# EAGLE design eurorack-passive-warp (EAGLE 9.6.2)
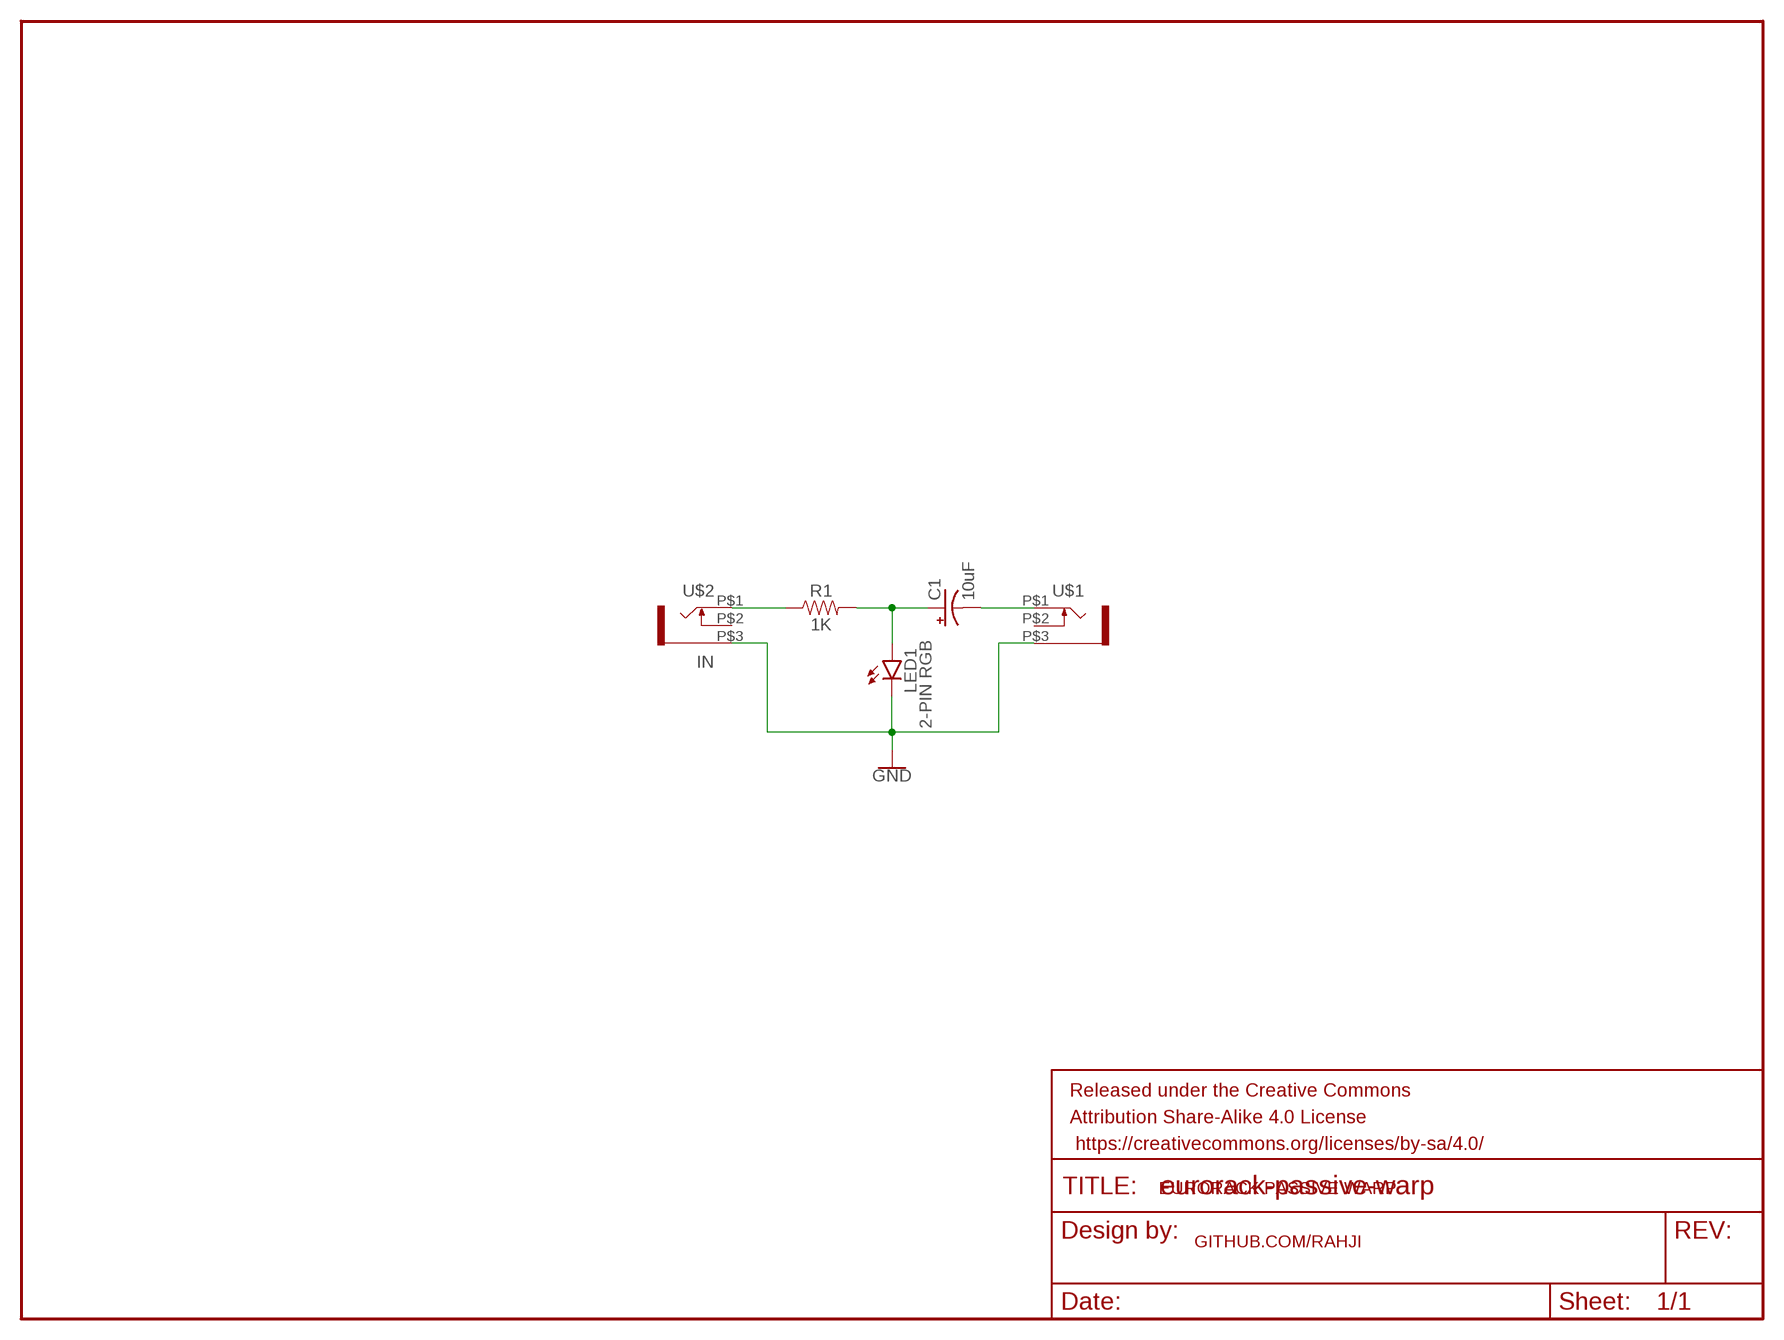
[diagram p0: schematic, sheet 1]

## Parts
C1  10uF  10UF-POLAR-RADIAL-2.5MM-25V-20%  [CPOL-RADIAL-2.5MM-5MM]
FRAME1  FRAME-LETTERNO_PACKAGE  [DUMMY]
LED1  2-PIN RGB  LED5MM  [LED5MM]
R1  1K  330OHM-HORIZ-1/10W-5%  [AXIAL-0.3]
U$1  OUT  WQP-PJ301M-12_JACK  [WQP-PJ301M-12_JACK]
U$2  IN  WQP-PJ301M-12_JACK  [WQP-PJ301M-12_JACK]

## Nets
GND: LED1.K(C) U$1.P$3 U$2.P$3
N$1: R1.P$1 U$2.P$1
N$2: C1.1(+) LED1.A R1.P$2
N$3: C1.2(-) U$1.P$1
Unconnected: U$1.P$2 U$2.P$2

## Notes on the sheet
- EURORACK PASSIVE WARP
- GITHUB.COM/RAHJI

## Library data of the parts
C1 = SparkFun-Capacitors:10UF-POLAR: 10.0µF polarized capacitors A capacitor is a passive two-terminal electrical component used to store electrical energy temporarily in an electric field.; PROD_ID: CAP-08440
FRAME1 = SparkFun-Aesthetics:FRAME-LETTER: Schematic Frame - Letter Standard 8.5x11 US Letter frame; DESIGNER: Nobody; VERSION: v01
LED1 = led:LED: LED OSRAM: - CHIPLED LG R971, LG N971, LY N971, LG Q971, LY Q971, LO R971, LY R971 LH N974, LH R974 LS Q976, LO Q976, LY Q976 LO Q996 - Hyper CHIPLED LW Q18S LB Q993, LB Q99A, LB R99A - SideLED LS A670, LO A670, LY A670, LG A670, LP A670 LB A673, LV A673, LT A673, LW A673 LH A674 LY A675 LS A676, LA A676, LO A676, LY A676, LW A676 LS A679, LY A679, LG A679 - Hyper Micro SIDELED® LS Y876, LA Y876, LO Y876, LY Y876 LT Y87S - SmartLED LW L88C, LW L88S LB L89C, LB L89S, LG L890 LS L89K, LO L89K, LY L89K LS L896, LA L896, LO L896, LY L896 - TOPLED LS T670, LO T670, LY T670, LG T670, LP T670 LSG T670, LSP T670, LSY T670, LOP T670, LYG T670 LG T671, LOG T671, LSG T671 LB T673, LV T673, LT T673, LW T673 LH T674 LS T676, LA T676, LO T676, LY T676, LB T676, LH T676, LSB T676, LW T676 LB T67C, LV T67C, LT T67C, LS T67K, LO T67K, LY T67K, LW E67C LS E67B, LA E67B, LO E67B, LY E67B, LB E67C, LV E67C, LT E67C LW T67C LS T679, LY T679, LG T679 LS T770, LO T770, LY T770, LG T770, LP T770 LB T773, LV T773, LT T773, LW T773 LH T774 LS E675, LA E675, LY E675, LS T675 LS T776, LA T776, LO T776, LY T776, LB T776 LHGB T686 LT T68C, LB T68C - Hyper Mini TOPLED® LB M676 - Mini TOPLED Santana® LG M470 LS M47K, LO M47K, LY M47K Source: http://www.osram.convergy.de LUXEON: - LUMILED® LXK2-PW12-R00, LXK2-PW12-S00, LXK2-PW14-U00, LXK2-PW14-V00 LXK2-PM12-R00, LXK2-PM12-S00, LXK2-PM14-U00 LXK2-PE12-Q00, LXK2-PE12-R00, LXK2-PE12-S00, LXK2-PE14-T00, LXK2-PE14-U00 LXK2-PB12-K00, LXK2-PB12-L00, LXK2-PB12-M00, LXK2-PB14-N00, LXK2-PB14-P00, LXK2-PB14-Q00 LXK2-PR12-L00, LXK2-PR12-M00, LXK2-PR14-Q00, LXK2-PR14-R00 LXK2-PD12-Q00, LXK2-PD12-R00, LXK2-PD12-S00 LXK2-PH12-R00, LXK2-PH12-S00 LXK2-PL12-P00, LXK2-PL12-Q00, LXK2-PL12-R00 Source: www.luxeon.com KINGBRIGHT: KA-3528ASYC Source: www.kingbright.com
R1 = SparkFun-Resistors:330OHM: 330Ω resistor A resistor is a passive two-terminal electrical component that implements electrical resistance as a circuit element. Resistors act to reduce current flow, and, at the same time, act to lower voltage levels within circuits. - Wikipedia; PROD_ID: RES-8371; VALUE: 330
U$1 U$2 = thonkiconn:WQP-PJ301M-12_JACK

## Board
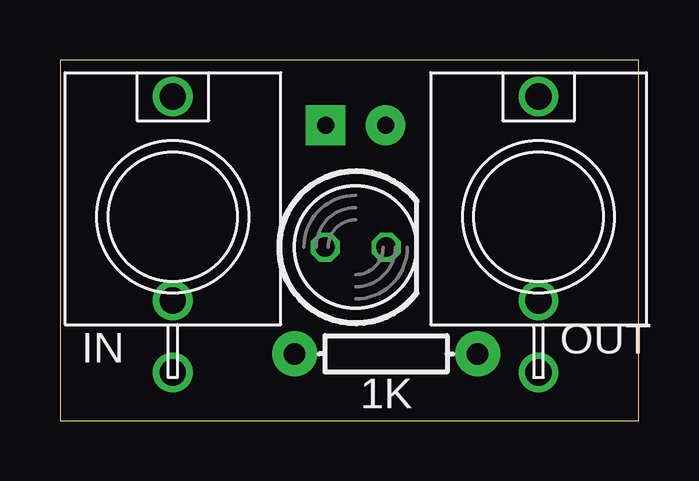
[diagram p1: board, top side]
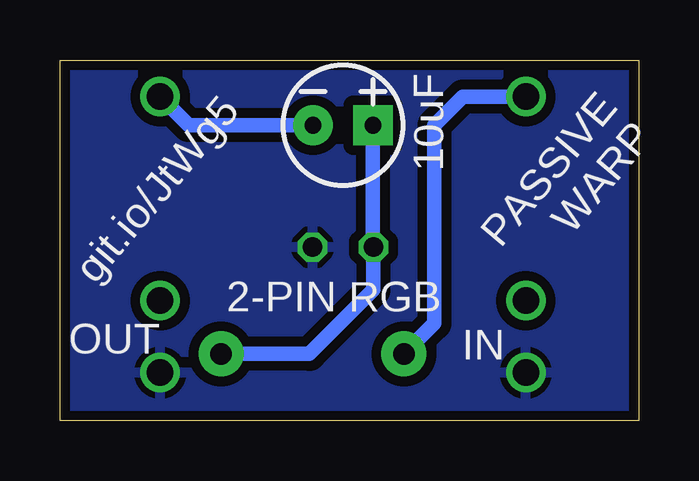
[diagram p2: board, bottom side, seen from below]

Size 24.11 x 15.04 mm. Coordinates in mm from the lower left corner, seen from the top.
Outline: 0,0 24.11,0 24.11,15.04 0,15.04 0,0
Copper layers (1*16): Top 0.0356mm / dielectric 1.5011mm / Bottom 0.0356mm
Design rules "oshpark-2layer": minimum track width 6mil, minimum drill 13mil, track to track 6mil, track to pad 6mil, pad to pad 6mil, via to via 6mil, smd to smd 6mil, copper to edge 15mil, drill to drill 6mil, minimum pad ring 7mil, minimum via ring 7mil, stop-mask expansion 2.5mil, vias tented up to drill 0mil, thermal gap 10mil

### Footprints (pad centres in the part's own frame; a part is rotated, then mirrored left to right if it is on the bottom)
CPOL-RADIAL-2.5MM-5MM = drill 0.7 pad 1.651 square: 1 1.25,0 | drill 0.7 pad 1.651: 2 -1.25,0
LED5MM = drill 0.813 octagon: A -1.27,0; K 1.27,0
AXIAL-0.3 = drill 0.9 pad 1.88: P$1 -3.81,0; P$2 3.81,0
WQP-PJ301M-12_JACK = drill 1.1: P$1 0,5; P$2 0,-3.5; P$3 0,-6.5

### Placement (x,y rotation side)
C1  12.32,12.32 0 bottom
FRAME1  -1.78,-2.03 0 top
LED1  12.32,7.24 0 top
R1  13.59,2.79 0 top
U$1  19.94,8.51 0 top
U$2  4.7,8.51 0 top

### Tracks (layer width: path | path; a pad name or v marks a point on that pad's centre or on a via)
GND
  pour Bottom (isolate 0.406): -1.78,17.02 26.16,17.02 26.16,-0.76 -1.78,-0.76
N$1
  Bottom 0.61: U$2.P$1 7.32,13.51 8.51,12.32 8.51,4.06 R1.P$1
N$2
  Bottom 0.61: C1.1 11.07,7.26 LED1.A 11.05,5.46 13.72,2.79 R1.P$2
N$3
  Bottom 0.61: C1.2 18.75,12.32 U$1.P$1

### Text on the board
tNames: IN | OUT
bNames: 10uF | PASSIVE / WARP | git.io/JtWg5 | IN | OUT